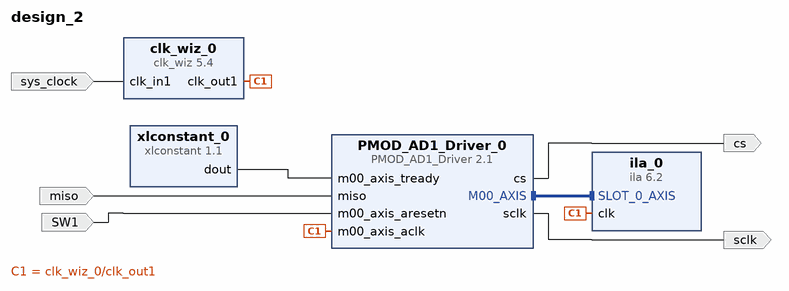
[diagram p0: block diagram of the top level]
# Vivado block design design_2, xc7z020clg484-1, Vivado 2017.4
create_bd_design design_2

create_bd_port -dir I miso
create_bd_port -dir O cs
create_bd_port -dir O sclk
create_bd_port -dir I -type clk sys_clock
set_property -dict {CONFIG.FREQ_HZ 100000000 CONFIG.PHASE 0.000} [get_bd_ports sys_clock]
create_bd_port -dir I SW1

create_bd_cell -type ip -vlnv xilinx.com:ip:ila:6.2 ila_0
set_property -dict {CONFIG.C_NUM_OF_PROBES 9 CONFIG.C_SLOT_0_AXI_PROTOCOL AXI4S} [get_bd_cells ila_0]
create_bd_cell -type ip -vlnv xilinx.com:ip:clk_wiz:5.4 clk_wiz_0
set_property -dict {CONFIG.USE_BOARD_FLOW true CONFIG.CLK_IN1_BOARD_INTERFACE sys_clock} [get_bd_cells clk_wiz_0]
create_bd_cell -type ip -vlnv xilinx.com:ip:xlconstant:1.1 xlconstant_0
create_bd_cell -type ip -vlnv xilinx.com:user:PMOD_AD1_Driver:2.1 PMOD_AD1_Driver_0
set_property -dict {CONFIG.C_M00_AXIS_TDATA_WIDTH 16 CONFIG.NUMBER_OF_OUTPUT_WORDS 512} [get_bd_cells PMOD_AD1_Driver_0]

# ---- connections ----

connect_bd_intf_net [get_bd_intf_pins PMOD_AD1_Driver_0/M00_AXIS] [get_bd_intf_pins ila_0/SLOT_0_AXIS]
connect_bd_net -net ADC_1 [get_bd_ports miso] [get_bd_pins PMOD_AD1_Driver_0/miso]
connect_bd_net [get_bd_pins PMOD_AD1_Driver_0/cs] [get_bd_ports cs]
connect_bd_net [get_bd_pins PMOD_AD1_Driver_0/sclk] [get_bd_ports sclk]
connect_bd_net [get_bd_pins clk_wiz_0/clk_out1] [get_bd_pins ila_0/clk] [get_bd_pins PMOD_AD1_Driver_0/m00_axis_aclk]
connect_bd_net [get_bd_ports sys_clock] [get_bd_pins clk_wiz_0/clk_in1]
connect_bd_net -net SW1_1 [get_bd_ports SW1] [get_bd_pins PMOD_AD1_Driver_0/m00_axis_aresetn]
connect_bd_net [get_bd_pins xlconstant_0/dout] [get_bd_pins PMOD_AD1_Driver_0/m00_axis_tready]

validate_bd_design
save_bd_design
